# EAGLE schematic sensor (EAGLE 7.3.0)
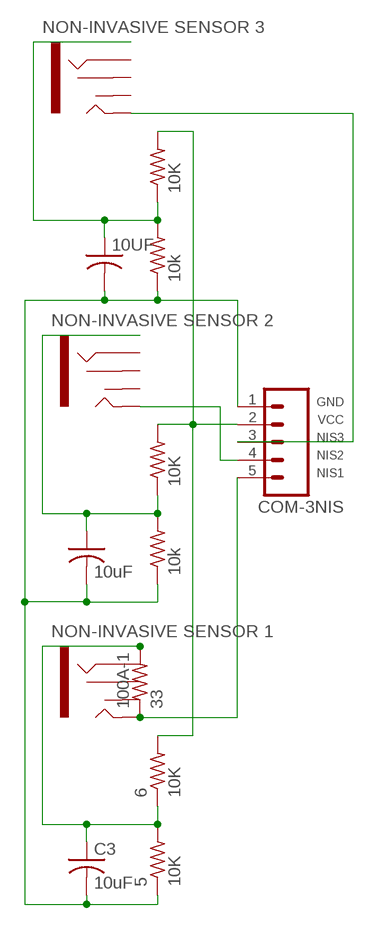
[diagram p0: schematic, sheet 1]

## Parts
1  10k  R-US_M0805  [M0805]
2  10K  R-US_M0805  [M0805]
3  10k  R-US_M0805  [M0805]
4  10K  R-US_M0805  [M0805]
5  10K  R-US_M0805  [M0805]
6  10K  R-US_M0805  [M0805]
10UF  C-USC0805K  [C0805K]
100A-1  33  R-US_M0805  [M0805]
C2  10uF  C-USC0805K  [C0805K]
C3  10uF  C-USC0805K  [C0805K]
COM-3NIS  M05PTH  [1X05]
U1  NON-INVASIVE SENSOR 1  AUDIO-JACK2PTH  [AUDIO-JACK]
U2  NON-INVASIVE SENSOR 2  AUDIO-JACK2PTH  [AUDIO-JACK]
U3  NON-INVASIVE SENSOR 3  AUDIO-JACK2PTH  [AUDIO-JACK]

## Nets
GND: 2.2 4.2 6.2 COM-3NIS.2
N$5: 1.2 2.1 10UF.1 U3.SLEEVE
N$9: 3.2 4.1 C2.1 U2.SLEEVE
N$14: 5.2 6.1 100A-1.2 C3.1 U1.SLEEVE
NIS1: 100A-1.1 COM-3NIS.5 U1.TIP
NIS2: COM-3NIS.4 U2.TIP
NIS3: COM-3NIS.3 U3.TIP
VCC: 1.1 3.1 5.1 10UF.2 C2.2 C3.2 COM-3NIS.1
Unconnected: U1.RING U1.RSH U1.TSH U2.RING U2.RSH U2.TSH U3.RING U3.RSH U3.TSH

## Library data of the parts
1-6 100A-1 = adafruit:R-US_: RESISTOR, American symbol
10UF C2 C3 = adafruit:C-US: CAPACITOR, American symbol
COM-3NIS = SparkFun-Connectors:M05: Header 5 Standard 5-pin 0.1" header. Use with straight break away headers (SKU : PRT-00116), right angle break away headers (PRT-00553), swiss pins (PRT-00743), machine pins (PRT-00117), and female headers (PRT-00115). Molex polarized connector foot print use with SKU : PRT-08230 with associated crimp pins and housings.
U1-U3 = SparkFun-Connectors:AUDIO-JACK2: Stereo audio jack with bypass switches. Used on LilyPad MP3 board. Production SKU: CONN-10353